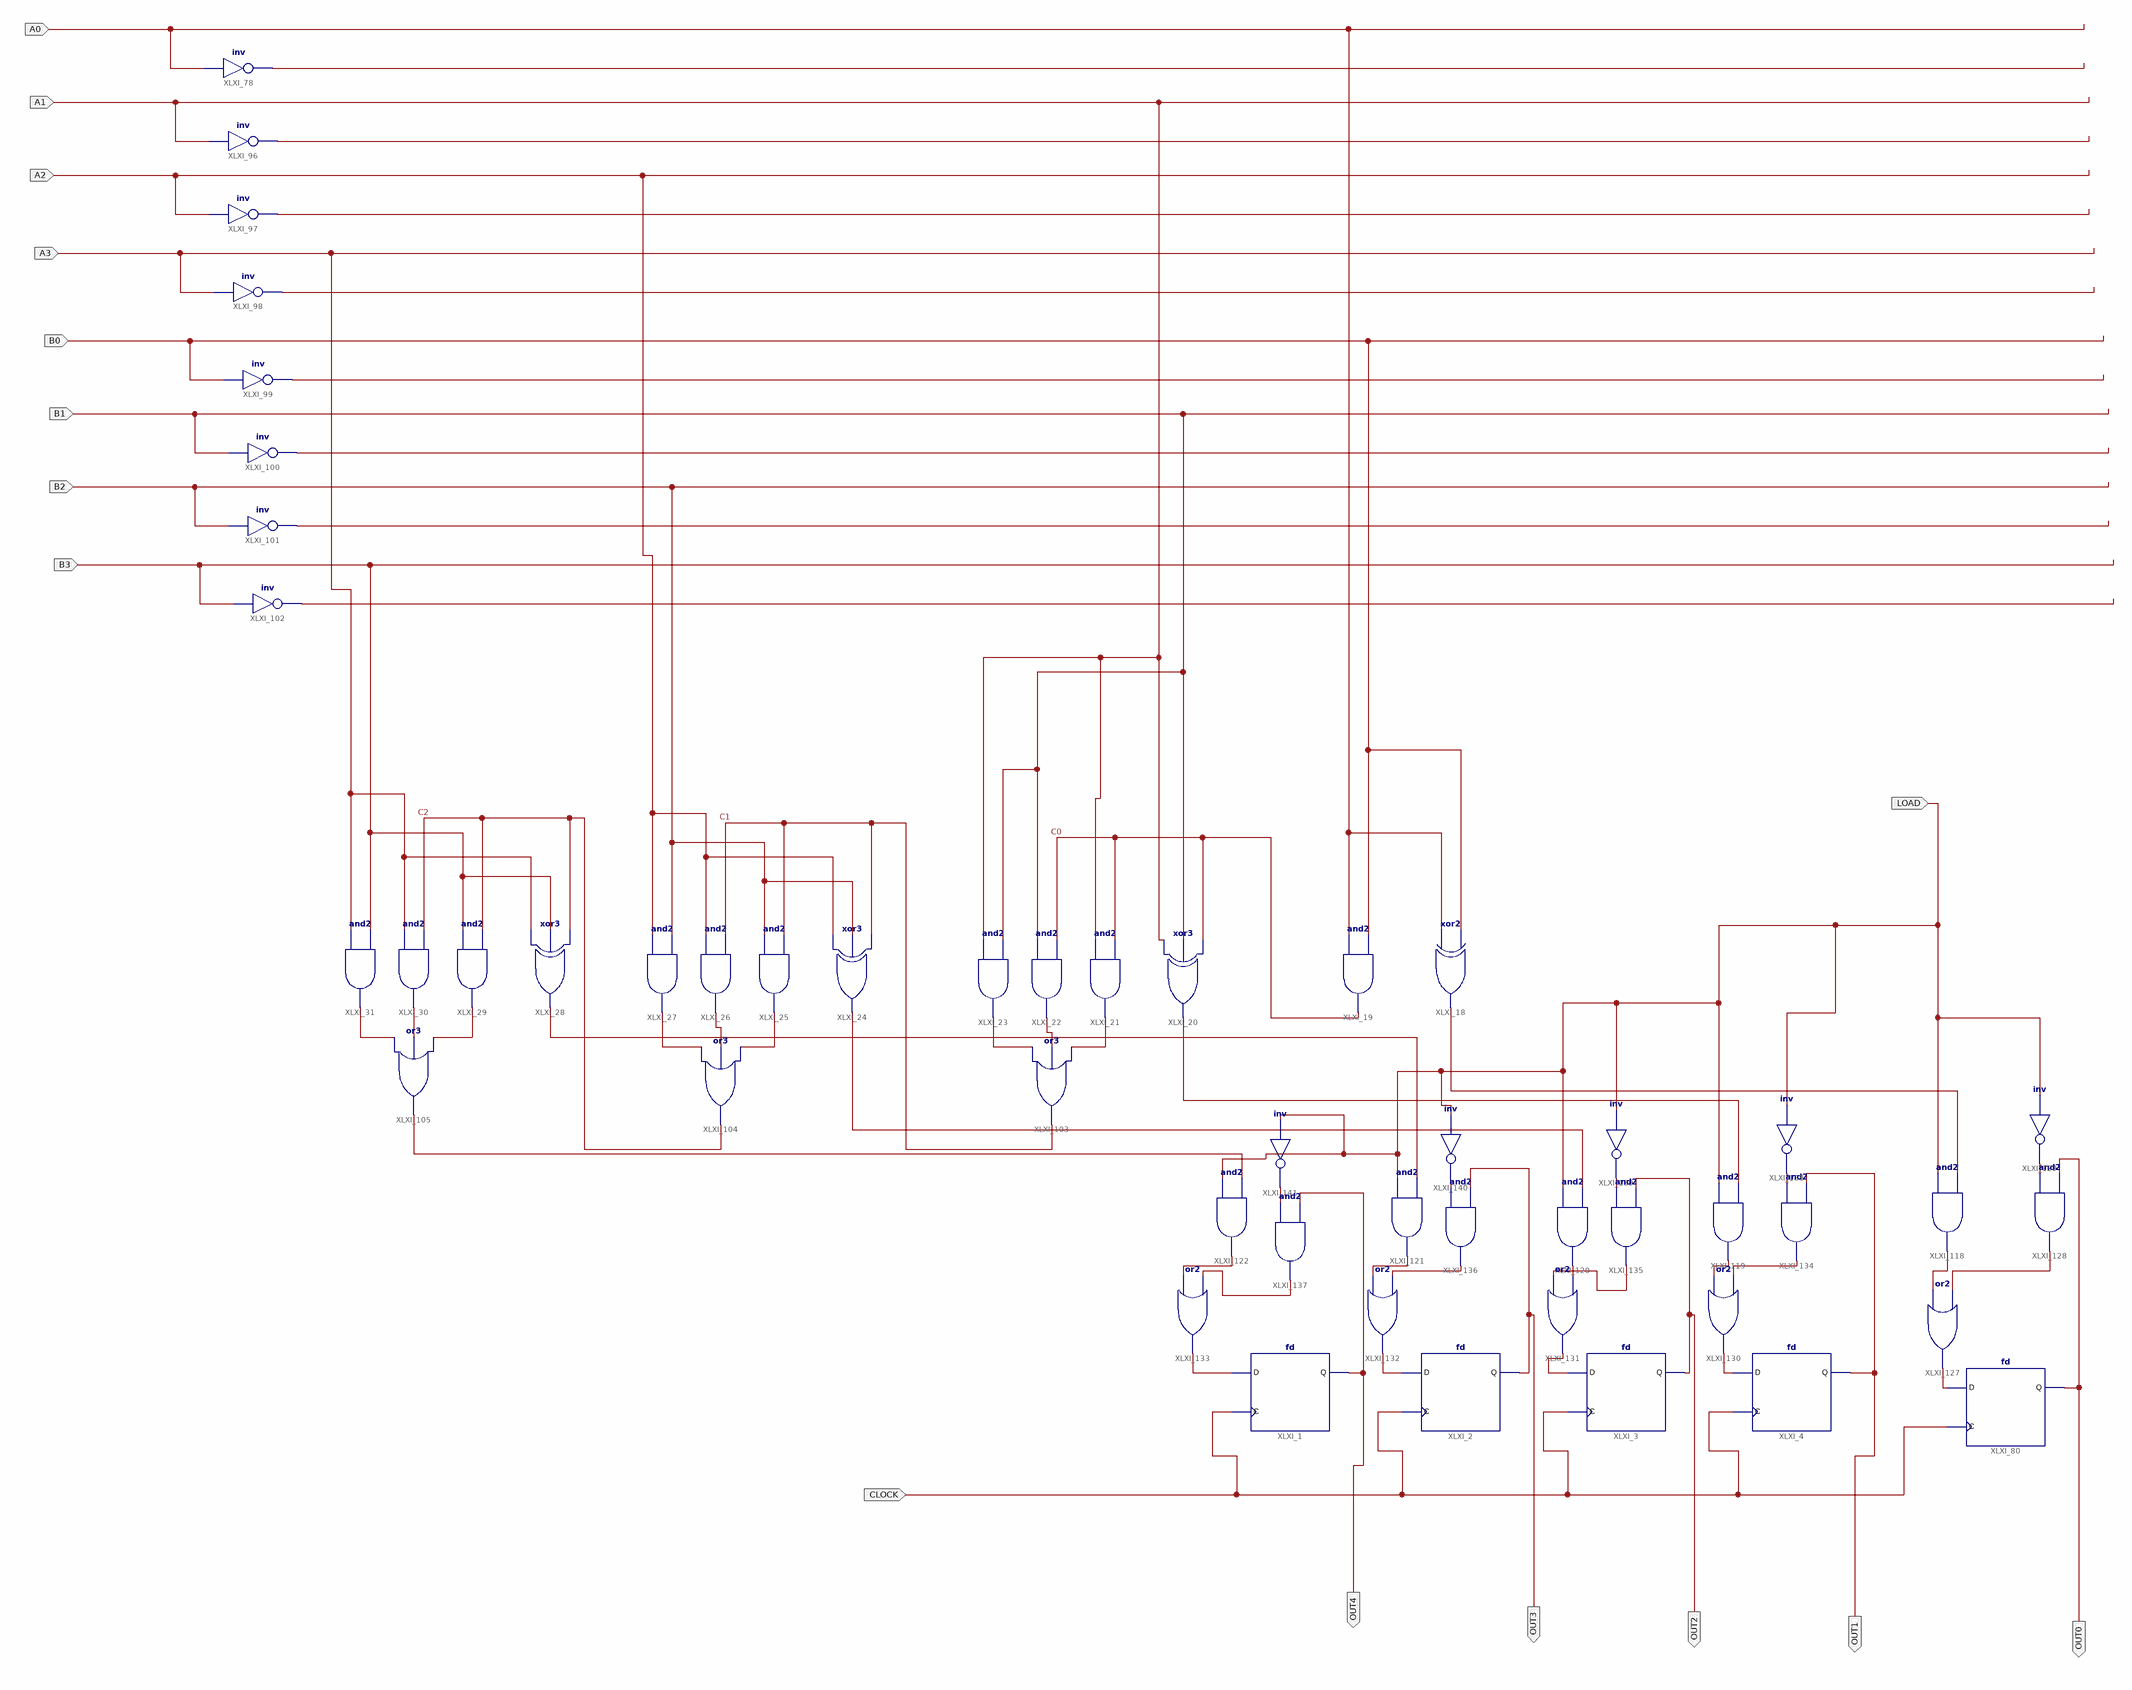
[diagram p0: schematic sheet 1]
// Xilinx ISE schematic Adder_schem.sch (spartan3e) as structural Verilog: 50 symbols, 15 ports
module Adder_schem (
  input  A0,
  input  A1,
  input  A2,
  input  A3,
  input  B0,
  input  B1,
  input  B2,
  input  B3,
  input  LOAD,
  input  CLOCK,
  output OUT4,
  output OUT3,
  output OUT2,
  output OUT1,
  output OUT0
);

  wire C0, C1, C2, C3, XLXN_17, XLXN_31, XLXN_33, XLXN_35, XLXN_37, XLXN_39, XLXN_41, XLXN_43, XLXN_52,
       XLXN_53, XLXN_54, XLXN_56, XLXN_57, XLXN_58, XLXN_60, XLXN_61, XLXN_62, XLXN_101, XLXN_102, XLXN_103,
       XLXN_104, XLXN_119, XLXN_123, XLXN_125, XLXN_126, XLXN_130, XLXN_131, XLXN_132, XLXN_133, XLXN_134,
       XLXN_135, XLXN_136, XLXN_137, XLXN_138, XLXN_139, XLXN_141, XLXN_142, XLXN_143, XLXN_146, XLXN_147,
       XLXN_148;

  not XLXI_78 (XLXN_17, A0);
  not XLXI_96 (XLXN_31, A1);
  not XLXI_97 (XLXN_33, A2);
  not XLXI_98 (XLXN_35, A3);
  not XLXI_99 (XLXN_37, B0);
  not XLXI_100 (XLXN_39, B1);
  not XLXI_101 (XLXN_41, B2);
  not XLXI_102 (XLXN_43, B3);
  xor XLXI_20 (XLXN_102, A1, B1, C0);
  and XLXI_21 (XLXN_53, A1, C0);
  and XLXI_22 (XLXN_52, B1, C0);
  and XLXI_23 (XLXN_54, A1, B1);
  xor XLXI_24 (XLXN_103, A2, B2, C1);
  and XLXI_25 (XLXN_58, B2, C1);
  and XLXI_26 (XLXN_57, A2, C1);
  and XLXI_27 (XLXN_56, A2, B2);
  xor XLXI_28 (XLXN_104, A3, B3, C2);
  and XLXI_29 (XLXN_60, B3, C2);
  and XLXI_30 (XLXN_61, A3, C2);
  and XLXI_31 (XLXN_62, A3, B3);
  or XLXI_103 (C1, XLXN_54, XLXN_52, XLXN_53);
  or XLXI_104 (C2, XLXN_56, XLXN_57, XLXN_58);
  or XLXI_105 (C3, XLXN_62, XLXN_61, XLXN_60);
  and XLXI_19 (C0, A0, B0);
  xor XLXI_18 (XLXN_101, A0, B0);
  fd XLXI_80 (.C(CLOCK), .D(XLXN_119), .Q(OUT0));
  and XLXI_118 (XLXN_125, LOAD, XLXN_101);
  and XLXI_119 (XLXN_147, LOAD, XLXN_102);
  and XLXI_120 (XLXN_142, LOAD, XLXN_103);
  and XLXI_121 (XLXN_138, LOAD, XLXN_104);
  and XLXI_122 (XLXN_135, LOAD, C3);
  fd XLXI_3 (.C(CLOCK), .D(XLXN_141), .Q(OUT2));
  fd XLXI_4 (.C(CLOCK), .D(XLXN_146), .Q(OUT1));
  fd XLXI_1 (.C(CLOCK), .D(XLXN_134), .Q(OUT4));
  fd XLXI_2 (.C(CLOCK), .D(XLXN_137), .Q(OUT3));
  or XLXI_127 (XLXN_119, XLXN_125, XLXN_126);
  and XLXI_128 (XLXN_126, XLXN_123, OUT0);
  not XLXI_129 (XLXN_123, LOAD);
  or XLXI_130 (XLXN_146, XLXN_147, XLXN_148);
  or XLXI_131 (XLXN_141, XLXN_143, XLXN_142);
  or XLXI_132 (XLXN_137, XLXN_138, XLXN_139);
  or XLXI_133 (XLXN_134, XLXN_135, XLXN_136);
  and XLXI_134 (XLXN_148, XLXN_130, OUT1);
  and XLXI_135 (XLXN_143, XLXN_131, OUT2);
  and XLXI_136 (XLXN_139, XLXN_132, OUT3);
  and XLXI_137 (XLXN_136, XLXN_133, OUT4);
  not XLXI_138 (XLXN_130, LOAD);
  not XLXI_139 (XLXN_131, LOAD);
  not XLXI_140 (XLXN_132, LOAD);
  not XLXI_141 (XLXN_133, LOAD);
endmodule
